# Altium schematic sheet JRDFinalSchem.SchDoc
size A; SheetNumber: 1; SheetTotal: 1
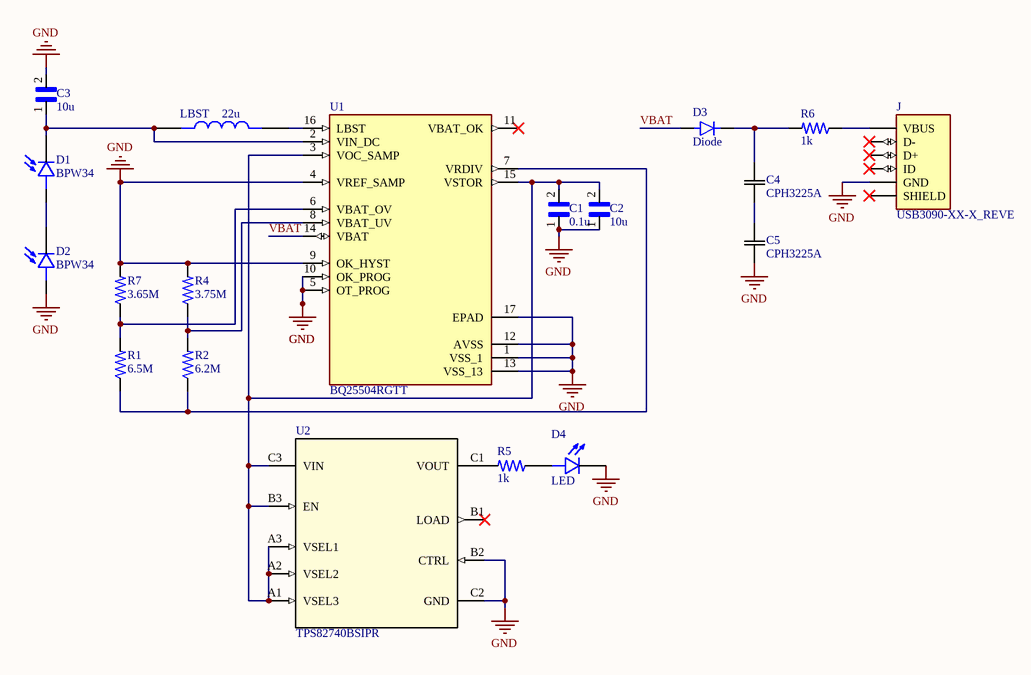
[diagram p0: JRDFinalSchem.SchDoc]

## Parts
C1  0.1u  [LED]
C2  10u  [LED]
C3  10u  [LED]
C4  CPH3225A  [CAP_CPH3225A_EPS]
C5  CPH3225A  [CAP_CPH3225A_EPS]
D1  BPW34  [DIO_BPW34]
D2  BPW34  [DIO_BPW34]
D3  Diode  [LED]
D4  LED  [LED]
J  USB3090-XX-X_REVE  [GCT_USB3090-XX-X_REVE]
LBST  22u  [Inductor]
R1  6.5M  [LED]
R2  6.2M  [LED]
R4  3.75M  [LED]
R5  1k  [LED]
R6  1k  [LED]
R7  3.65M  [LED]
U1  BQ25504RGTT  [QFN50P300X300X100-17N]
U2  TPS82740BSIPR  [SIP0009F]

## Nets
GND: C1.1 C2.1 C3.2 C5.1 D2.A D4.2(C) J.5(GND) R4.2 R7.2 U1.1(VSS_1) U1.4(VREF_SAMP) U1.5(OT_PROG) U1.9(OK_HYST) U1.10(OK_PROG) U1.12(AVSS) U1.13(VSS_13) U1.17(EPAD) U2.B2(CTRL) U2.C2(GND)
VBAT: D3.1(A) U1.14(VBAT)
NetC1_2: C1.2 C2.2 U1.3(VOC_SAMP) U1.15(VSTOR) U2.A1(VSEL3) U2.A2(VSEL2) U2.A3(VSEL1) U2.B3(EN) U2.C3(VIN)
NetC3_1: C3.1 D1.C LBST.1 U1.2(VIN_DC)
NetC4_1: C4.1 C5.2
NetC4_2: C4.2 D3.2(C) R6.2
NetD1_A: D1.A D2.C
NetD4_1: D4.1(A) R5.1
NetJ_1: J.1(VBUS) R6.1
NetLBST_2: LBST.2 U1.16(LBST)
NetR1_1: R1.1 R2.1 U1.7(VRDIV)
NetR1_2: R1.2 R7.1 U1.6(VBAT_OV)
NetR2_2: R2.2 R4.1 U1.8(VBAT_UV)
NetR5_2: R5.2 U2.C1(VOUT)

Not connected (* = marked no-connect by the designer): J 2(D-)* 3(D+)* 4(ID)* 7(SHIELD)*; U1 11(VBAT_OK)*; U2 B1(LOAD)*

## Library data of the parts
C1-C3 = Capacitor: MF: Samsung; MP: CL21A106KAYNNNE; Value: *; Check_prices: https://www.snapeda.com/parts/CL21A106KAYNNNE/Samsung/view-part/3598482/?ref=eda; Package: 0805 Samsung; SnapEDA_Link: https://www.snapeda.com/parts/CL21A106KAYNNNE/Samsung/view-part/3598482/?ref=snap; Digi-Key_Part_Number: 1276-2891-1-ND
C4 C5 = CPH3225A: No Description Available; Mfr_Name: Epson; Type: DEV; Copyright: Copyright (C) 2022 Ultra Librarian. All rights reserved.; Manufacturer_Part_Number: CPH3225A; Digi-Key_Part_Number_1: 728-1127-2-ND; Digi-Key_Part_Number_2: 728-1127-1-ND; Digi-Key_Part_Number_3: 728-1127-6-ND; RefDes: RefDes
D1 D2 = BPW34: Photodiode 900nm  130Â° 2-DIP (0.200, 5.10mm); MF: Vishay Semiconductors; Purchase-URL: https://pricing.snapeda.com/search/part/BPW34/?ref=eda; Value: *; Package: DIP-2 Vishay Semiconductors; MP: BPW34; Availability: Good; SnapEDA_Link: https://www.snapeda.com/parts/BPW34/Vishay/view-part/4725084/?ref=snap; Check_prices: https://www.snapeda.com/parts/BPW34/Vishay/view-part/4725084/?ref=eda; Price: None
D3 = Diode: Diode Standard 1000V 1A Through Hole DO-204AL _DO-41_; MF: ON Semiconductor; MP: 1N4007; Package: DO-41 Good-Ark; Value: *; Price: None; Availability: Unavailable; SnapEDA_Link: https://www.snapeda.com/parts/1N4007/ON%20Semiconductor/view-part/2816213/?ref=snap
D4 = LED: Red 623nm LED Indication - Discrete 1.9V Radial; MF: Wurth Electronics; MP: 151054RS03000; Value: *; SnapEDA_Link: https://www.snapeda.com/parts/151054RS03000/Wurth%20Electronics%20Inc./view-part/609365/?ref=snap; Price: None; Availability: Unavailable; Package: Radial WÃ¼rth Elektronik
J = USB3090-XX-X_REVE: USB - micro AB USB 2.0 Receptacle Connector 5 Position Surface Mount, Right Angle; Through Hole; MP: USB3090-30-A; MF: Global Connector Technology; SnapEDA_Link: https://www.snapeda.com/parts/USB3090-30-A/Global%20Connector%20Technology/view-part/281875/?ref=snap; Price: None; Availability: Unavailable; Value: *; Package: None
LBST = Inductor: Line Inductors for RECOM Power Supply; MP: RLS-186-R; SnapEDA_Link: https://www.snapeda.com/parts/RLS-186-R/Recom%20Power/view-part/3641537/?ref=snap; Availability: Unavailable; MF: Recom Power; Package: Nonstandard Recom Power; Value: *; Price: None
R1 R2 R4-R7 = Resistor: 0805; MF: Vishay Dale; MP: PNM0402E5001BST1; Value: *; Digi-Key_Part_Number: 541-1901-1-ND; Package: 0402 Vishay; SnapEDA_Link: https://www.snapeda.com/parts/PNM0402E5001BST1/Vishay%20Dale/view-part/103724/?ref=snap
U1 = BQ25504RGTT: Ultra Low Power Boost Converter with Battery Management for Energy Harvester | Nano-Power Management 16-VQFN -40 to 85; Package: None; Price: None; Value: *; MP: BQ25504RGTT; Availability: Unavailable
U2 = TPS82740BSIPR: No Description Available; Mfr_Name: Texas Instruments; Type: DEV; RefDes: RefDes; Copyright: Copyright (C) 2022 Ultra Librarian. All rights reserved.; Manufacturer_Part_Number: TPS82740BSIPR; Digi-Key_Part_Number_1: 296-46481-1-ND; Digi-Key_Part_Number_2: 296-46481-2-ND; Digi-Key_Part_Number_3: 296-46481-6-ND; Digi-Key_Part_Number_4: TPS82740BSIPR-ND